# Altium schematic sheet PCB.PSU.DCDC.001.A1.SchDoc
size A3
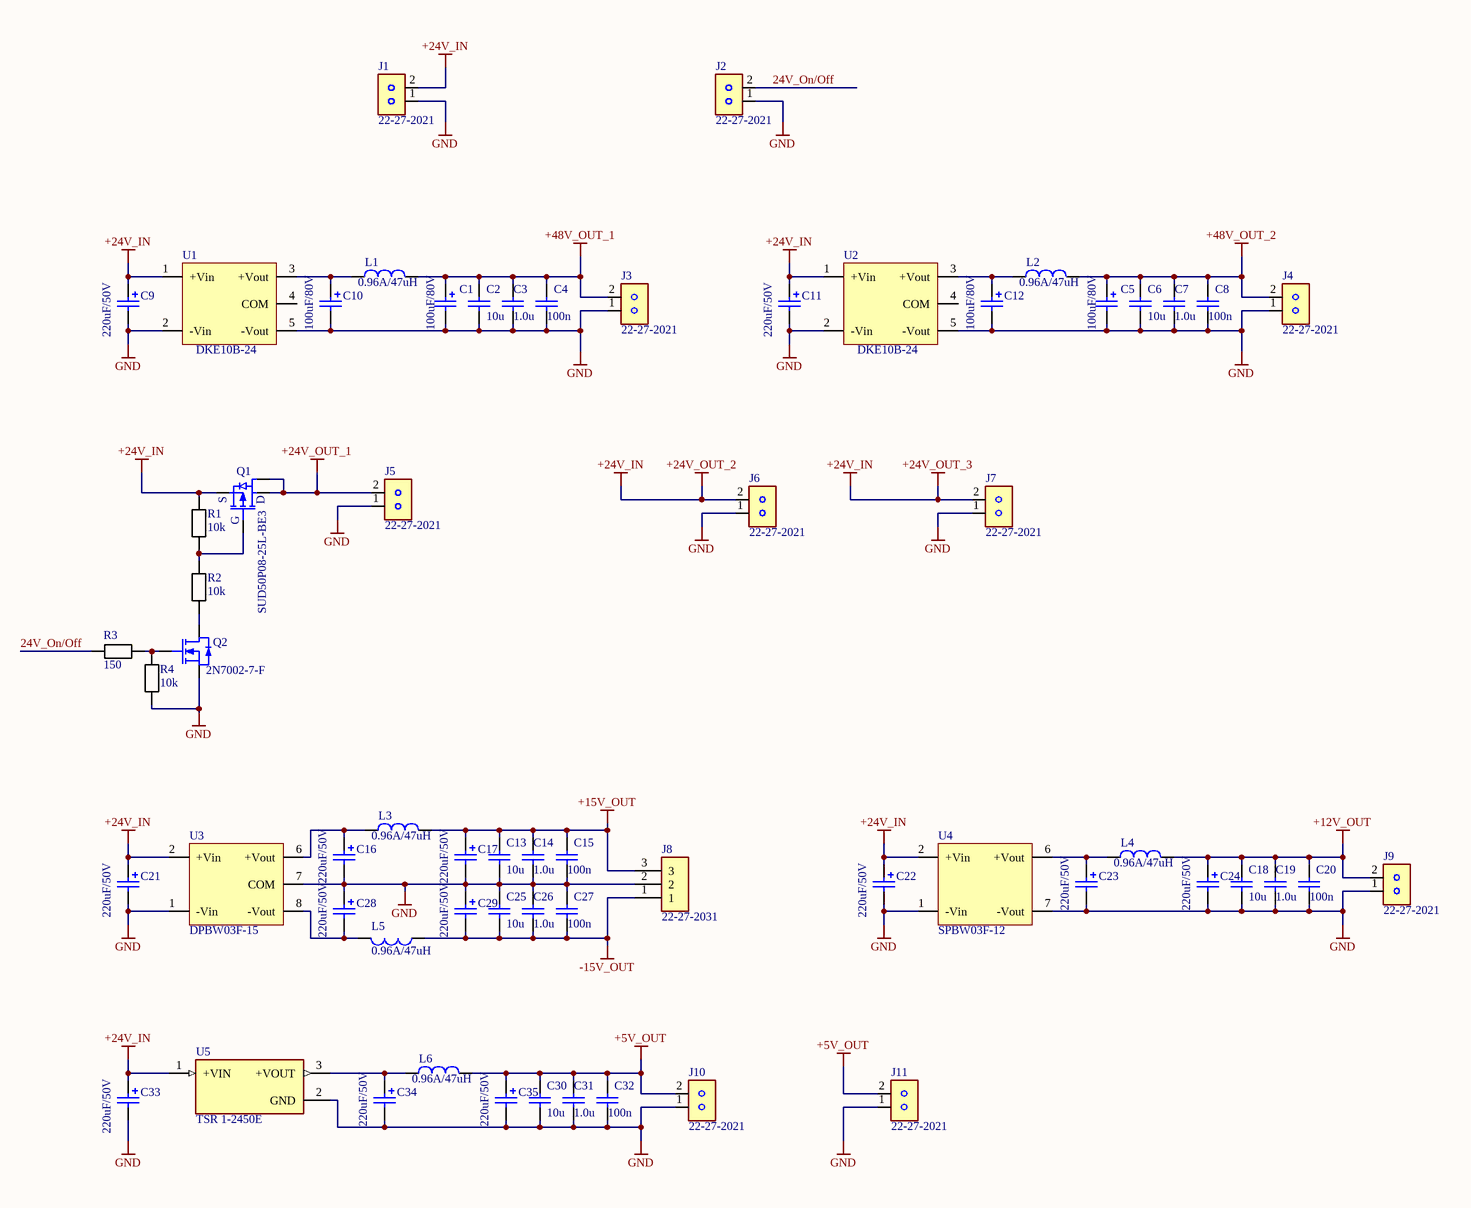
[diagram p0: PCB.PSU.DCDC.001.A1.SchDoc]

## Parts
C1  100uF/80V  [CAP_EEU-FS1K101B]
C2  10u  [C1206]
C3  1.0u  [C0603]
C4  100n  [C0603]
C5  100uF/80V  [CAP_EEU-FS1K101B]
C6  10u  [C1206]
C7  1.0u  [C0603]
C8  100n  [C0603]
C9  220uF/50V  [CAP_ESL227M050AH8AA]
C10  100uF/80V  [CAP_EEU-FS1K101B]
C11  220uF/50V  [CAP_ESL227M050AH8AA]
C12  100uF/80V  [CAP_EEU-FS1K101B]
C13  10u  [C1206]
C14  1.0u  [C0603]
C15  100n  [C0603]
C16  220uF/50V  [CAP_ESL227M050AH8AA]
C17  220uF/50V  [CAP_ESL227M050AH8AA]
C18  10u  [C1206]
C19  1.0u  [C0603]
C20  100n  [C0603]
C21  220uF/50V  [CAP_ESL227M050AH8AA]
C22  220uF/50V  [CAP_ESL227M050AH8AA]
C23  220uF/50V  [CAP_ESL227M050AH8AA]
C24  220uF/50V  [CAP_ESL227M050AH8AA]
C25  10u  [C1206]
C26  1.0u  [C0603]
C27  100n  [C0603]
C28  220uF/50V  [CAP_ESL227M050AH8AA]
C29  220uF/50V  [CAP_ESL227M050AH8AA]
C30  10u  [C1206]
C31  1.0u  [C0603]
C32  100n  [C0603]
C33  220uF/50V  [CAP_ESL227M050AH8AA]
C34  220uF/50V  [CAP_ESL227M050AH8AA]
C35  220uF/50V  [CAP_ESL227M050AH8AA]
J1  22-27-2021  [MOLEX_22-27-2021]
J2  22-27-2021  [MOLEX_22-27-2021]
J3  22-27-2021  [MOLEX_22-27-2021]
J4  22-27-2021  [MOLEX_22-27-2021]
J5  22-27-2021  [MOLEX_22-27-2021]
J6  22-27-2021  [MOLEX_22-27-2021]
J7  22-27-2021  [MOLEX_22-27-2021]
J8  22-27-2031  [MOLEX_22-27-2031]
J9  22-27-2021  [MOLEX_22-27-2021]
J10  22-27-2021  [MOLEX_22-27-2021]
J11  22-27-2021  [MOLEX_22-27-2021]
L1  0.96A/47uH  [IND_RLB0912]
L2  0.96A/47uH  [IND_RLB0912]
L3  0.96A/47uH  [IND_RLB0912]
L4  0.96A/47uH  [IND_RLB0912]
L5  0.96A/47uH  [IND_RLB0912]
L6  0.96A/47uH  [IND_RLB0912]
Q1  SUD50P08-25L-BE3  [TO-252-3]
Q2  2N7002-7-F  [SOT23-3N]
R1  10k  [R0603]
R2  10k  [R0603]
R3  150  [R0603]
R4  10k  [R0603]
U1  DKE10B-24  [DKE10B-24]
U2  DKE10B-24  [DKE10B-24]
U3  DPBW03F-15  [DPBW03F-15]
U4  SPBW03F-12  [SPBW03F-12]
U5  TSR 1-2450E  [CONV_TSR_1-2450E]

## Nets
+5V_OUT: C30.2 C31.2 C32.2 C35.1 J10.2 J11.2 L6.2
+12V_OUT: C18.2 C19.2 C20.2 C24.1 J9.2 L4.2
+15V_OUT: C13.2 C14.2 C15.2 C17.1 J8.3 L3.2
+24V_IN: C9.1 C11.1 C21.1 C22.1 C33.1 J1.2 J6.2 J7.2 Q1.3(S) R1.2 U1.1(+Vin) U2.1(+Vin) U3.2(+Vin) U4.2(+Vin) U5.1(+VIN)  [also labelled +24V_OUT_2, +24V_OUT_3]
+24V_OUT_1: J5.2 Q1.2(D)
+48V_OUT_1: C1.1 C2.2 C3.2 C4.2 J3.2 L1.2
+48V_OUT_2: C5.1 C6.2 C7.2 C8.2 J4.2 L2.2
-15V_OUT: C25.1 C26.1 C27.1 C29.2 J8.1 L5.1
GND: C1.2 C2.1 C3.1 C4.1 C5.2 C6.1 C7.1 C8.1 C9.2 C10.2 C11.2 C12.2 C13.1 C14.1 C15.1 C16.2 C17.2 C18.1 C19.1 C20.1 C21.2 C22.2 C23.2 C24.2 C25.2 C26.2 C27.2 C28.1 C29.1 C30.1 C31.1 C32.1 C33.2 C34.2 C35.2 J1.1 J2.1 J3.1 J4.1 J5.1 J6.1 J7.1 J8.2 J9.1 J10.1 J11.1 Q2.2(S) R4.1 U1.2(-Vin) U1.5(-Vout) U2.2(-Vin) U2.5(-Vout) U3.1(-Vin) U3.7(COM) U4.1(-Vin) U4.7(-Vout) U5.2(GND)
24V_On/Off: J2.2 R3.1
NetC10_1: C10.1 L1.1 U1.3(+Vout)
NetC12_1: C12.1 L2.1 U2.3(+Vout)
NetC16_1: C16.1 L3.1 U3.6(+Vout)
NetC23_1: C23.1 L4.1 U4.6(+Vout)
NetC28_2: C28.2 L5.2 U3.8(-Vout)
NetC34_1: C34.1 L6.1 U5.3(+VOUT)
NetQ1_1: Q1.1(G) R1.1 R2.2
NetQ2_1: Q2.1(G) R3.2 R4.2
NetQ2_3: Q2.3(D) R2.1

Not connected (* = marked no-connect by the designer): U1 4(COM); U2 4(COM)

## Library data of the parts
C1 C5 C10 C12 = Cap_Electrolytic: CAP ALUM 220UF 20% 50V SMD; MPN: EEU-FS1K101B; MFR: KEMET; Value: 100uF/80V; Price: 0.68
C2 C6 C13 C18 C25 C30 = CAP_YAG_CC1206KKX7R8BB106: Capacitor 10u 1206 +-10% 25V; MFR: Yageo; Type: X7R; Voltage (V): 50; MPN: CC1206KKX7R8BB106; Category: Capacitor; Tolerance: +-10%; Value: 10u; Price: 0.44
C3 C7 C14 C19 C26 C31 = CAP_YAG_CC0603KRX7R9BB105_X7R: Capacitor 1.0u 0603 +-10% 50V; MFR: Yageo; Type: X7R; Voltage (V): 50; Part Number: CAP_YAG_CC0603KRX7R9BB105_X7R; MPN: CC0603KRX7R9BB105; Category: Capacitor; Package / Case: 0603; Capacitor (Farad): 1.0u; Tolerance: +-10%; Thickness (mm): 0.8; Value: 1.0u; Price: 0.1
C4 C8 C15 C20 C27 C32 = CAP_YAG_CC0603KRX7R9BB104_X7R: Capacitor 100n 0603 +-10% 50V; MFR: Yageo; Type: X7R; Voltage (V): 50; Part Number: CAP_YAG_CC0603KRX7R9BB104_X7R; MPN: CC0603KRX7R9BB104; Package / Case: 0603; Capacitor (Farad): 100n; Tolerance: +-10%; Thickness (mm): 0.8; Value: 100n; Price: 0.1
C9 C11 C16 C17 C21-C24 C28 C29 C33-C35 = Cap_Electrolytic: CAP ALUM 220UF 20% 50V SMD; MPN: ESL227M050AH8AA; MFR: KEMET; Value: 220uF/50V; Price: 0.68
J1-J7 J9-J11 = 22-27-2021: Connector Wire to Board Header 2 Position 2.54mm Solder Straight Thru-Hole Ba; MFR: Molex; Package: None; Price: 0.3; Value: 22-27-2021; MPN: 22-27-2021; Availability: Unavailable
J8 = 22-27-2031: Connector Header Through Hole 3 position 0.100 _2.54mm_; MFR: Molex; Value: 22-27-2031; Package: TQFP-144 Molex; Price: 0.43; MPN: 22-27-2031; Availability: Unavailable; SnapEDA_Link: https://www.snapeda.com/parts/22-27-2031/Molex/view-part/523256/?ref=snap
L1-L6 = Inductor: Power Inductors - Leaded 47uH 10% .96A; MFR: Bourns; MPN: RLB0912-470KL; Supplier: Mouser; Supplier Part Number: 652-RLB0912-470KL; Price: 0.49; Value: 0.96A/47uH
Q1 = SUD50P08-25L-BE3: MOSFET 80V P-CH MOSFET (D-S) 17; MFR: Vishay; MPN: SUD50P08-25L-BE3; Value: SUD50P08-25L-BE3; Price: 2.74
Q2 = MOSFET-N: MOSFET N-CH 60V 200MA SOT23-3; MFR: Diodes Incorporated; MPN: 2N7002-7-F; Value: 2N7002-7-F; Price: 0.2
R1 R2 R4 = RES_YAG_RC0603FR-0710KL: Resistor 10k 0603 +-1% 0.1; MFR: Yageo; Temperature Coefficient: +-200ppm°C; Power (Watts): 0.1; Voltage (V): 75; Part Number: RES_YAG_RC0603FR-0710KL; MPN: RC0603FR-0710KL; Category: Resistor; Package / Case: 0603; Resistor (Ohms): 10k; Tolerance: +-1%; Operating Temperature: -55°C to +155°C; Thickness (mm): 0.45; Value: 10k; Price: 0.1
R3 = RES_YAG_RC0603FR-07150RL: Resistor 150 0603 +-1% 0.1; MFR: Yageo; Temperature Coefficient: +-200ppm°C; Power (Watts): 0.1; Voltage (V): 75; Part Number: RES_YAG_RC0603FR-07150RL; MPN: RC0603FR-07150RL; Category: Resistor; Package / Case: 0603; Resistor (Ohms): 150; Tolerance: +-1%; Operating Temperature: -55°C to +155°C; Thickness (mm): 0.45; Value: 150; Price: 0.1
U1 U2 = DKE10B-24: Isolated DC/DC Converters - Through Hole 18-36Vin +/-24Vout 21-210mA, 10W; MFR: MEAN WELL; MPN: DKE10B-24; Price: 22.3; Value: DKE10B-24
U3 = DPBW03F-15: Isolated DC/DC Converters - Through Hole 9-36Vin +/-15Vout +/-100mA SIP Reg Iso; MFR: MEAN WELL; MPN: DPBW03F-15; Price: 10.8; Value: DPBW03F-15
U4 = SPBW03F-12: Isolated DC/DC Converters - Through Hole 9-36Vin 12Vout 250mA SIP8 Reg Iso; MFR: MEAN WELL; MPN: SPBW03F-12; Price: 10.8; Value: SPBW03F-12
U5 = TSR_1-2450E: 1 Amp POL converter, industrial, 6-36 VDC input, pos.-pos. circuit, cost efficient, LM78 compatible, SIP-3; MFR: Traco Power; Check_prices: https://www.snapeda.com/parts/TSR%201-2450E/Traco%20Power/view-part/4817566/?ref=eda; MPN: TSR 1-2450E; Package: SIP-3 Traco Power; Price: 3.92; Availability: In Stock; Purchase-URL: https://pricing.snapeda.com/search/part/TSR 1-2450E/?ref=eda; SnapEDA_Link: https://www.snapeda.com/parts/TSR%201-2450E/Traco%20Power/view-part/4817566/?ref=snap; Value: TSR 1-2450E